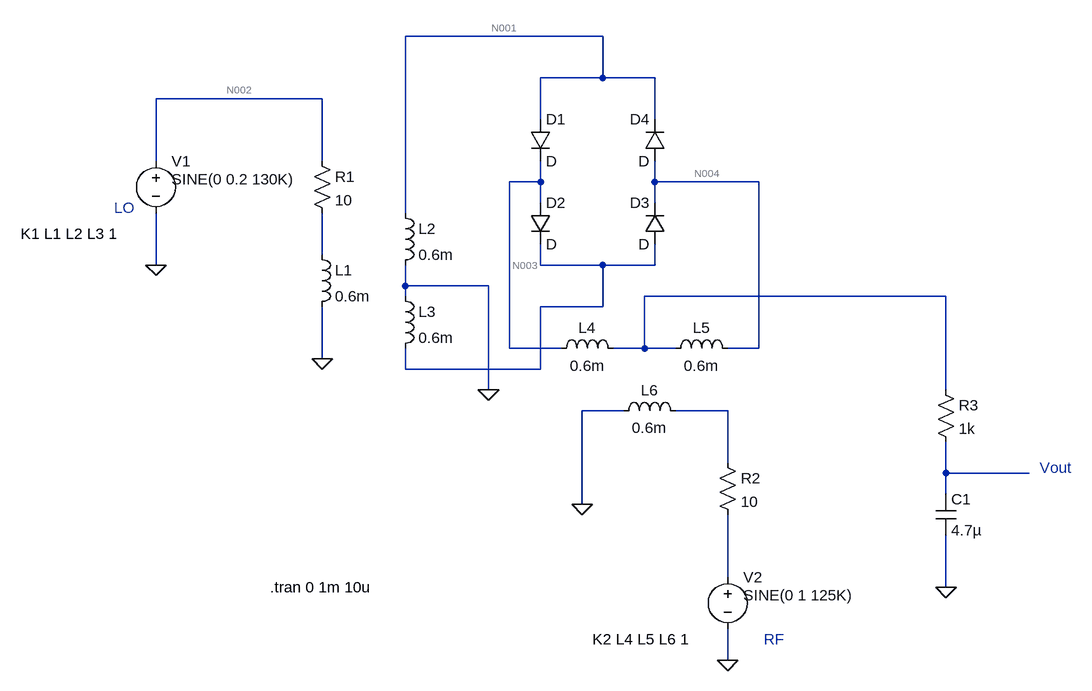
[diagram p0: schematic ring diode mixer.asc]
ring diode mixer.asc, the LTspice schematic file:
Version 4.1
SHEET 1 1456 884
WIRE 416 -96 112 -96
WIRE 416 -32 416 -96
WIRE 416 -32 320 -32
WIRE 496 -32 416 -32
WIRE -16 0 -272 0
WIRE 320 32 320 -32
WIRE 496 32 496 -32
WIRE -272 96 -272 0
WIRE -16 96 -16 0
WIRE 320 128 320 96
WIRE 320 128 272 128
WIRE 496 128 496 96
WIRE 656 128 496 128
WIRE 320 160 320 128
WIRE 496 160 496 128
WIRE 112 176 112 -96
WIRE -16 240 -16 176
WIRE -272 256 -272 176
WIRE 320 256 320 224
WIRE 416 256 320 256
WIRE 496 256 496 224
WIRE 496 256 416 256
WIRE 112 288 112 256
WIRE 240 288 112 288
WIRE 112 304 112 288
WIRE 944 304 480 304
WIRE 416 320 416 256
WIRE 416 320 320 320
WIRE 272 384 272 128
WIRE 352 384 272 384
WIRE 480 384 480 304
WIRE 480 384 432 384
WIRE 528 384 480 384
WIRE 656 384 656 128
WIRE 656 384 608 384
WIRE -16 400 -16 320
WIRE 112 416 112 384
WIRE 320 416 320 320
WIRE 320 416 112 416
WIRE 240 448 240 288
WIRE 944 448 944 304
WIRE 448 480 384 480
WIRE 608 480 528 480
WIRE 608 560 608 480
WIRE 944 576 944 528
WIRE 1072 576 944 576
WIRE 944 608 944 576
WIRE 384 624 384 480
WIRE 608 736 608 640
WIRE 944 752 944 672
WIRE 608 864 608 816
FLAG -272 256 0
FLAG -16 400 0
FLAG 240 448 0
FLAG 608 864 0
FLAG 944 752 0
FLAG 384 624 0
SYMBOL voltage -272 80 R0
WINDOW 3 24 44 Left 2
WINDOW 123 0 0 Left 0
WINDOW 39 0 0 Left 0
SYMATTR InstName V1
SYMATTR Value SINE(0 0.2 130K)
SYMBOL res -32 80 R0
SYMATTR InstName R1
SYMATTR Value 10
SYMBOL ind -32 224 R0
SYMATTR InstName L1
SYMATTR Value 0.6m
SYMATTR Type ind
SYMBOL ind 96 160 R0
SYMATTR InstName L2
SYMATTR Value 0.6m
SYMATTR Type ind
SYMBOL ind 96 288 R0
SYMATTR InstName L3
SYMATTR Value 0.6m
SYMATTR Type ind
SYMBOL diode 304 32 R0
SYMATTR InstName D1
SYMBOL diode 304 160 R0
SYMATTR InstName D2
SYMBOL diode 512 224 R180
WINDOW 0 24 64 Left 2
WINDOW 3 24 0 Left 2
SYMATTR InstName D3
SYMBOL diode 512 96 R180
WINDOW 0 24 64 Left 2
WINDOW 3 24 0 Left 2
SYMATTR InstName D4
SYMBOL ind 336 400 R270
WINDOW 0 32 56 VTop 2
WINDOW 3 5 56 VBottom 2
SYMATTR InstName L4
SYMATTR Value 0.6m
SYMATTR Type ind
SYMBOL ind 512 400 R270
WINDOW 0 32 56 VTop 2
WINDOW 3 5 56 VBottom 2
SYMATTR InstName L5
SYMATTR Value 0.6m
SYMATTR Type ind
SYMBOL ind 432 496 R270
WINDOW 0 32 56 VTop 2
WINDOW 3 5 56 VBottom 2
SYMATTR InstName L6
SYMATTR Value 0.6m
SYMATTR Type ind
SYMBOL res 592 544 R0
SYMATTR InstName R2
SYMATTR Value 10
SYMBOL res 928 432 R0
SYMATTR InstName R3
SYMATTR Value 1k
SYMBOL voltage 608 720 R0
WINDOW 3 24 44 Left 2
WINDOW 123 0 0 Left 0
WINDOW 39 0 0 Left 0
SYMATTR InstName V2
SYMATTR Value SINE(0 1 125K)
SYMBOL cap 928 608 R0
SYMATTR InstName C1
SYMATTR Value 4.7µ
TEXT -336 168 Left 2 ;LO
TEXT 1088 568 Left 2 ;Vout
TEXT -480 208 Left 2 !K1 L1 L2 L3 1
TEXT 400 832 Left 2 !K2 L4 L5 L6 1
TEXT -96 752 Left 2 !.tran 0 1m 10u
TEXT 664 832 Left 2 ;RF

The netlist it stands for:
* ring diode mixer.asc
V1 N002 0 SINE(0 0.2 130K)
R1 N002 N005 10
L1 N005 0 0.6m
L2 N001 0 0.6m
L3 0 N006 0.6m
D1 N001 N003 D
D2 N003 N006 D
D3 N006 N004 D
D4 N004 N001 D
L4 N003 N007 0.6m
L5 N007 N004 0.6m
L6 0 N008 0.6m
R2 N008 N010 10
R3 N007 N009 1k
V2 N010 0 SINE(0 1 125K)
C1 N009 0 4.7µ
.model D D
.lib standard.dio
* LO
* Vout
K1 L1 L2 L3 1
K2 L4 L5 L6 1
.tran 0 1m 10u
* RF
.backanno
.end

* Results of the author's LTspice run, read from the files saved beside the schematic
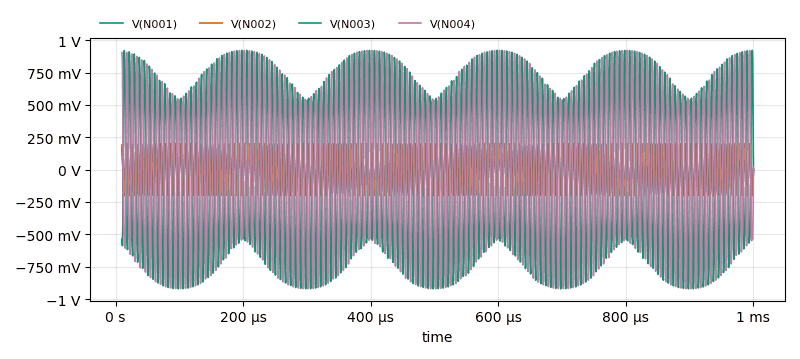
[diagram p1: Transient Analysis of ring diode mixer.asc, plotted from the saved traces]
* Transient Analysis, 1 run:
*   V(N001): min -202 mV, max 200.1 mV, average -529.8 µV, rms 141.1 mV, last 4.032 mV
*   V(N002): min -200 mV, max 200 mV, average -312.6 µV, rms 142.1 mV, last 0 V
*   V(N003): min -920.9 mV, max 921.1 mV, average 928.6 µV, rms 596.5 mV, last -17.97 mV
*   V(N004): min -920.7 mV, max 920.9 mV, average -3.169 mV, rms 595.6 mV, last 17.95 mV